# Altium schematic sheet Zasilanie_A4_Landscape_.SchDoc
size A4; Author: Michał Berdzik; CompanyName: AGH
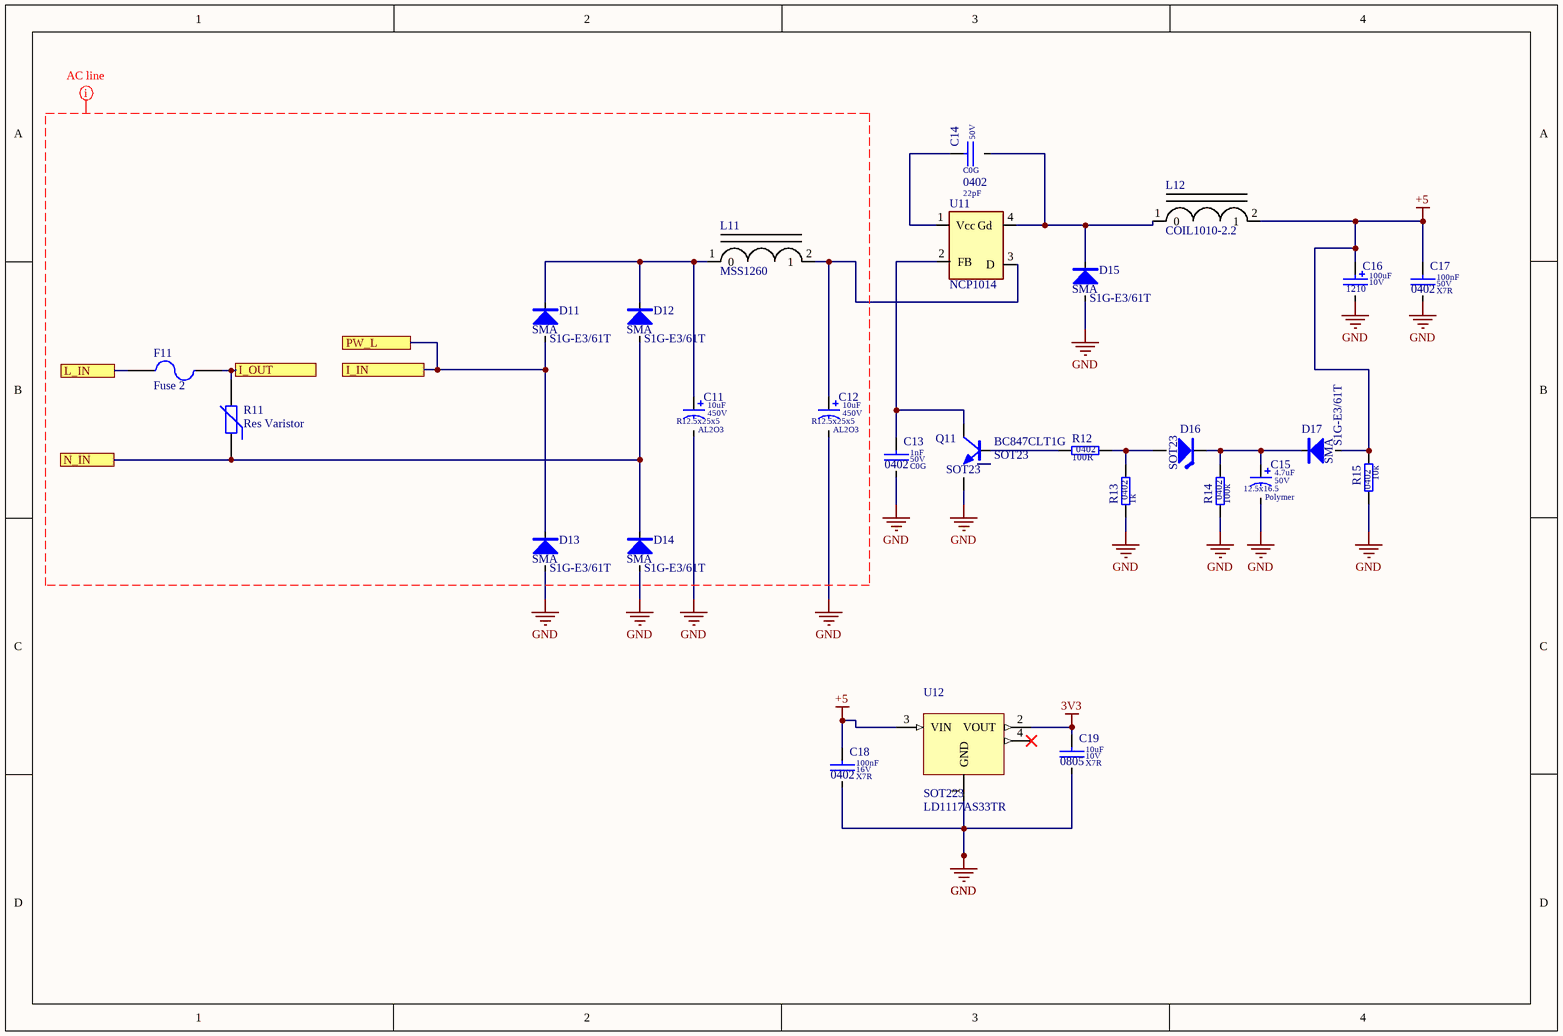
[diagram p0: Zasilanie_A4_Landscape_.SchDoc]

## Parts
C11  value 10uF  Dielectric: AL2O3  SCH_Footprint: R12.5x25x5  Voltage: 450V  [C_12.5x25x5]  (hidden comment: Electrolytic Capacitor)
C12  value 10uF  Dielectric: AL2O3  SCH_Footprint: R12.5x25x5  Voltage: 450V  [C_12.5x25x5]  (hidden comment: Electrolytic Capacitor)
C13  value 1nF  Dielectric: C0G  Voltage: 50V  SCH_Footprint: 0402  [C_0402_1005]  (hidden comment: Ceramic C0G)
C14  value 22pF  Dielectric: C0G  Voltage: 50V  SCH_Footprint: 0402  [C_0402_1005]  (hidden comment: Ceramic C0G)
C15  value 4.7uF  Dielectric: Polymer  SCH_Footprint: 12.5x16.5  Voltage: 50V  [CE_D_12.5x16.5MM]  (hidden comment: Electrolytic Capacitor)
C16  value 100uF  SCH_Footprint: 1210  Voltage: 10V  [CT_1210_3225]  (hidden comment: Tantalum Capacitor)
C17  value 100nF  Dielectric: X7R  Voltage: 50V  SCH_Footprint: 0402  [C_0402_1005]  (hidden comment: Ceramic X7R)
C18  value 100nF  Dielectric: X7R  Voltage: 16V  SCH_Footprint: 0402  [C_0402_1005]  (hidden comment: Ceramic X7R)
C19  value 10uF  Dielectric: X7R  Voltage: 10V  SCH_Footprint: 0805  [C_0805_2012]  (hidden comment: Ceramic X7R)
D11  value S1G-E3/61T  SCH_Footprint: SMA  [SMA_DO-214AC]  (hidden comment: S1G-E3)
D12  value S1G-E3/61T  SCH_Footprint: SMA  [SMA_DO-214AC]  (hidden comment: S1G-E3)
D13  value S1G-E3/61T  SCH_Footprint: SMA  [SMA_DO-214AC]  (hidden comment: S1G-E3)
D14  value S1G-E3/61T  SCH_Footprint: SMA  [SMA_DO-214AC]  (hidden comment: S1G-E3)
D15  value S1G-E3/61T  SCH_Footprint: SMA  [SMA_DO-214AC]  (hidden comment: S1G-E3)
D16  SCH_Footprint: SOT23  [D_SOT23_TO236_SC59]  (hidden comment: BZX84-C3V9)
D17  value S1G-E3/61T  SCH_Footprint: SMA  [SMA_DO-214AC]  (hidden comment: S1G-E3)
F11  Fuse 2  [PIN-W2/E2.8]
L11  MSS1260  [MSS1260]
L12  COIL1010-2.2  [COIL1010-2.2]
Q11  value BC847CLT1G  SCH_Footprint: SOT23  [SOT23_TO236_SC59]  (hidden comment: BC847C)
R11  Res Varistor  [6-0805_N]
R12  value 100R  SCH_Footprint: 0402  [R_0402_1005]  (hidden comment: Resistor)
R13  value 1k  SCH_Footprint: 0402  [R_0402_1005]  (hidden comment: Resistor)
R14  value 100k  SCH_Footprint: 0402  [R_0402_1005]  (hidden comment: Resistor)
R15  value 10k  SCH_Footprint: 0402  [R_0402_1005]  (hidden comment: Resistor)
U11  NCP1014  [NCP1014_SOT-223]
U12  SCH_Footprint: SOT223  [SOT223_SC73]  (hidden comment: LD1117AS33TR)

## Ports
I_IN, I_OUT, L_IN, N_IN, PW_L

## Nets
3V3: C19.1 U12.2(VOUT)
+5: C16.1 C17.1 C18.1 D17.2 L12.2(1) R15.1 U12.3(VIN)
GND: C11.2 C12.2 C13.2 C15.2 C16.2 C17.2 C18.2 C19.2 D13.2 D14.2 D15.2 Q11.2(E) R13.1 R14.1 R15.2 U12.1(GND)
I_IN: D11.2 D13.1 ; port I_IN, port PW_L
I_OUT: F11.2 R11.2 ; port I_OUT
L_IN: F11.1 ; port L_IN
N_IN: D12.2 D14.1 R11.1 ; port N_IN
NetC11_1: C11.1 D11.1 D12.1 L11.1(0)
NetC12_1: C12.1 L11.2(1) U11.3(D)
NetC13_1: C13.1 Q11.3(C) U11.2(FB)
NetC14_1: C14.1 U11.1(Vcc)
NetC14_2: C14.2 D15.1 L12.1(0) U11.4(Gd)
NetC15_1: C15.1 D16.1(K) D17.1 R14.2
NetD16_2: D16.2(A) R12.2 R13.2
NetQ11_1: Q11.1(B) R12.1

Not connected (* = marked no-connect by the designer): U12 4(VOUT)*

## Layout directives
rule Width Constraint [Pref Width = 40mil    Min Width = 30mil    Max Width = 50mil]; rule Clearance Constraint [Generic clearance = 0.4mm, and 10 value(s) for objects]: (no net found under the mark)

## Library data of the parts
C11 C12 = CE_15uF_450V_12.5x25x5_20: Polarized Capacitor; Manufacturer: Nichicon; Manufacturer Part Number: UCS2W150MHD; Tolerance (%): 20; Part Number: CE_15uF_450V_12.5x25x5_20; HelpURL: http://www.tme.eu/pl/Document/7efb657cbecf7a47c65caa99b85d4c4b/e-cs.pdf; Supplier 1: TME; Supplier Part Number 1: UCS2W150MHD; Supplier 2: RS Components; Supplier 3: Farnell; Supplier 4: Mouser; Supplier 5: Digi-Key
C13 = C_1nF_50V_C0G_0402_5: Capacitor; Manufacturer: Murata; Manufacturer Part Number: GRM1555C1H102JA01D; Tolerance (%): 5; Part Number: C_1nF_50V_C0G_0402_5; HelpURL: http://www.tme.eu/en/Document/e3e731e59cc68b1ab6d46b158bb05733/MURATA_GRM.pdf; Supplier 1: TME; Supplier Part Number 1: GRM1555C1H102JA01D; Supplier 2: RS Components; Supplier Part Number 2: 6242913; Supplier 3: Farnell; Supplier Part Number 3: 2408520; Supplier 4: Mouser; Supplier Part Number 4: 81-GRM1555C1H102JA1D; Supplier 5: Digi-Key; Supplier Part Number 5: 490-3244-1-ND
C14 = C_22pF_50V_C0G_0402_5: Capacitor; Manufacturer: AVX; Manufacturer Part Number: 04025A220JAT2A; Tolerance (%): 5; Part Number: C_22pF_50V_C0G_0402_5; HelpURL: http://datasheet.octopart.com/04025A220JAT2A-AVX-datasheet-9883399.pdf; Supplier 1: TME; Supplier Part Number 1: 04025A220JAT2A; Supplier 2: RS Components; Supplier Part Number 2: 6983087; Supplier 3: Farnell; Supplier Part Number 3: 2280776; Supplier 4: Mouser; Supplier Part Number 4: 581-04025A220J; Supplier 5: Digi-Key; Supplier Part Number 5: 478-1074-1-ND
C15 = CE_470uF_50V_Polymer_12.5x16.5_20: Polarized Capacitor; Manufacturer: United Chemi-Con; Manufacturer Part Number: EMVA500ARA471MKG5S; Tolerance (%): 20; Part Number: CE_470uF_50V_Polymer_12.5x16.5_20; HelpURL: https://datasheet.octopart.com/EMVA500ARA471MKG5S-United-Chemi-Con-datasheet-15540548.pdf; Supplier 1: TME; Supplier 2: RS Components; Supplier 3: Farnell; Supplier Part Number 3: 2842044; Supplier 4: Mouser; Supplier Part Number 4: 661-EMVA500ARA471MKG; Supplier 5: Digi-Key; Supplier Part Number 5: 565-2136-1-ND
C16 = CT_100uF_10V_TA2O5_1210_20: Capacitor; Manufacturer: AVX; Manufacturer Part Number: TAJB107M010RNJ; Dielectric: TA2O5; Tolerance (%): 20; Part Number: CT_100uF_10V_TA2O5_1210_20; HelpURL: https://datasheet.octopart.com/TAJB107M010RNJ-AVX-datasheet-12511273.pdf; Supplier 1: TME; Supplier Part Number 1: TAJB107M010R; Supplier 2: RS Components; Supplier Part Number 2: 1360118; Supplier 3: Farnell; Supplier Part Number 3: 1658150; Supplier 4: Mouser; Supplier Part Number 4: 581-TAJB107M010R; Supplier 5: Digi-Key; Supplier Part Number 5: 478-5801-1-ND
C17 = C_100nF_50V_X7R_0402_10: Capacitor; Manufacturer: Murata; Manufacturer Part Number: GRM155R71H104KE14D; Tolerance (%): 10; Part Number: C_100nF_50V_X7R_0402_10; HelpURL: http://docs-europe.electrocomponents.com/webdocs/145f/0900766b8145f9d2.pdf; Supplier 1: TME; Supplier Part Number 1: GRM155R71H104KE14D; Supplier 2: RS Components; Supplier Part Number 2: 8847087; Supplier 3: Farnell; Supplier Part Number 3: 2611912; Supplier 4: Mouser; Supplier Part Number 4: 81-GRM155R71H104KE4D; Supplier 5: Digi-Key; Supplier Part Number 5: 490-10700-1-ND
C18 = C_100nF_16V_X7R_0402_10: Capacitor; Manufacturer: Murata; Manufacturer Part Number: GRM155R71C104KA88D; Tolerance (%): 10; Part Number: C_100nF_16V_X7R_0402_10; HelpURL: https://www.mouser.com/ds/2/281/c02e-2905.pdf; Supplier 1: TME; Supplier 2: RS Components; Supplier 3: Farnell; Supplier 4: Mouser; Supplier Part Number 4: 81-GRM155R71C104KA88; Supplier 5: Digi-Key
C19 = C_10uF_10V_X7R_0805_10: Capacitor; Manufacturer: Samsung Electro-Mechanics; Manufacturer Part Number: CL21B106KPQNNNG; Tolerance (%): 10; Part Number: C_10uF_10V_X7R_0805_10; HelpURL: http://www.tme.eu/pl/Document/4a42202b32dab16128fe107dd69598cc/samsung-chip-cap.pdf; Supplier 1: TME; Supplier Part Number 1: CL21B106KPQNNNG; Supplier 2: RS Components; Supplier 3: Farnell; Supplier 4: Mouser; Supplier 5: Digi-Key
D11-D15 D17 = D_S1GE3/61T_1A_400V_SMA: Manufacturer: Vishay; Voltage: 400V; Current: 1A; Part Number: D_S1GE3/61T_1A_400V_SMA; HelpURL: https://www.verical.com/datasheet/vishay-rectifier-s1be3-61t-768273.pdf; Manufacturer Part Number: S1G-E3/61T; Supplier 1: TME; Supplier Part Number 1: S1G-E3/61T; Supplier 2: RS Components; Supplier Part Number 2: 7001243; Supplier 3: Farnell; Supplier Part Number 3: 1837206; Supplier 4: Mouser; Supplier Part Number 4: 625-S1G-E3; Supplier 5: Digi-Key; Supplier Part Number 5: S1G-E3/61TGICT-ND
D16 = DZ_3V9-SOT23: Zener; Voltage: 3.9V; Part Number: DZ_3V9-SOT23; Supplier 1: TME; Supplier 2: RS Components; Supplier 3: Farnell; Supplier 4: Mouser; Supplier 5: Digi-Key
F11 = Fuse 2: Fuse; Published: 8-Jun-2000; LatestRevisionDate: 17-Jul-2002; LatestRevisionNote: Re-released for DXP Platform.; PackageReference: PIN-W2/E2.8; Publisher: Altium Limited; PackageDescription: Thru-Hole; 2 Leads
L12 = COIL1010-2.2: Value: 2.2mH 550mA; SupplierPartNumber: *; Supplier: *
Q11 = QNP_BC847C_45V_0A1: Manufacturer: ON Semiconductor; Type: NPN; Voltage: 45V; Current: 0A1; Part Number: QNP_BC847C_45V_0A1; HelpURL: https://assets.nexperia.com/documents/data-sheet/BC847_SER.pdf; Manufacturer Part Number: BC847CLT1G; Supplier 1: TME; Supplier Part Number 1: BC847CLT1G; Supplier 2: RS Components; Supplier 3: Farnell; Supplier 4: Mouser; Supplier 5: Digi-Key; Supplier Part Number 5: BC847CLT1GOSCT-ND
R11 = Res Varistor: Varistor (Voltage-Sensitive Resistor); Published: 24-Mar-1999; LatestRevisionDate: 29-May-2009; LatestRevisionNote: IPC-7351 Footprint Added.; PackageVersion: Mar-2003; PackageReference: 6-0805; Publisher: Altium Limited; PackageDescription: Chip Resistor 0805 Case Size; Code_IPC: RESC2012
R12 = R_100R_0402_1: Manufacturer: Vishay; Manufacturer Part Number: CRCW0402100RFKTDBC; Voltage: 50V; Power: 63mW; Tolerance: 1%; Part Number: R_100R_0402_1; HelpURL: http://www.tme.eu/pl/Document/f9483914239ddfe8619d910f45cc0572/crcw0402_dbc.pdf; Supplier 1: TME; Supplier Part Number 1: CRCW0402100RFKTDBC; Supplier 2: RS Components; Supplier 3: Farnell; Supplier 4: Mouser; Supplier 5: Digi-Key
R13 = R_1k_0402: Manufacturer: Yageo; Manufacturer Part Number: RC0402FR-071K; Voltage: 50V; Power: 63mW; Tolerance: 1%; Part Number: R_1k_0402; HelpURL: http://www.tme.eu/pl/Document/1a2bc76e2be68b3b1670068306778ce6/rc0402yageo.pdf; Supplier 1: TME; Supplier Part Number 1: RC0402FR-071K; Supplier 2: RS Components; Supplier 3: Farnell; Supplier 4: Mouser; Supplier 5: Digi-Key
R14 = R_100k_0402_1: Manufacturer: Yageo; Manufacturer Part Number: RC0402FR-07100KL; Voltage: 50V; Power: 63mW; Tolerance: 1%; Part Number: R_100k_0402_1; HelpURL: http://www.tme.eu/pl/Document/1a2bc76e2be68b3b1670068306778ce6/rc0402yageo.pdf; Supplier 1: TME; Supplier Part Number 1: RC0402FR-07100K; Supplier 2: RS Components; Supplier 3: Farnell; Supplier Part Number 3: 2131798; Supplier 4: Mouser; Supplier Part Number 4: 603-RC0402FR-07100KL; Supplier 5: Digi-Key; Supplier Part Number 5: 311-100KLRCT-ND
R15 = R_10k_0402_1: Manufacturer: Yageo; Manufacturer Part Number: RC0402FR-0710KL; Voltage: 50V; Power: 63mW; Tolerance: 1%; Part Number: R_10k_0402_1; HelpURL: http://www.tme.eu/pl/Document/1a2bc76e2be68b3b1670068306778ce6/rc0402yageo.pdf; Supplier 1: TME; Supplier Part Number 1: RC0402FR-0710K; Supplier 2: RS Components; Supplier 3: Farnell; Supplier 4: Mouser; Supplier 5: Digi-Key
U12 = VL_LD1117AS33TR_3V3_1A2: Low-Dropout Positive Voltage Regulator; Manufacturer: STMicroelectronics; Voltage: 3.3V; Current: 1A2; Part Number: VL_LD1117AS33TR_3V3_1A2; Value: LD1117AS33TR; HelpURL: http://www.tme.eu/pl/Document/bad00e7fc591b73ff810af309b2bb7a4/LD1117A.pdf; Manufacturer Part Number: LD1117AS33TR; Supplier 1: TME; Supplier Part Number 1: LD1117AS33; Supplier 2: RS Components; Supplier 3: Farnell; Supplier Part Number 3: 1467776; Supplier 4: Mouser; Supplier Part Number 4: LD1117AS33; Supplier 5: Digi-Key; Supplier Part Number 5: 497-1228-1-ND
L11 = MSS1260: Value: *; SupplierPartNumber: *; Supplier: *
U11 = NCP1014: Value: *; SupplierPartNumber: *; Supplier: *